# Altium schematic sheet BatteryBalancing.SchDoc: Active Cell Balancing Circuit
size 279 x 215 mm; Engineer: Ari Wasch; Revision: 2; SheetNumber: 2; SheetTotal: 2
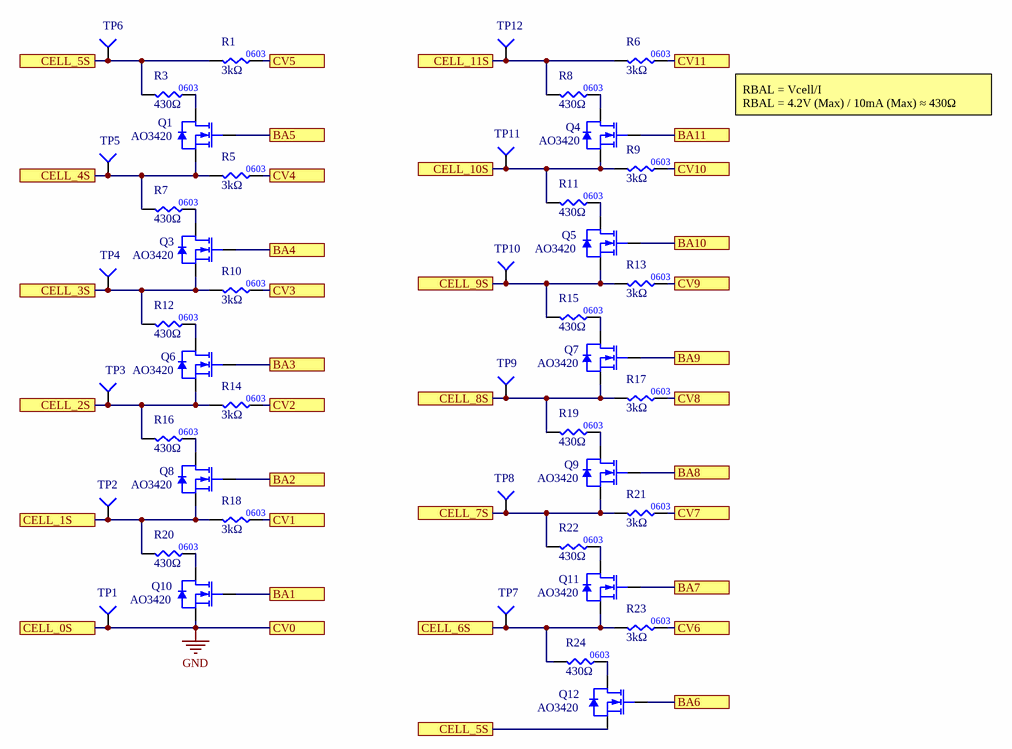
[diagram p0: BatteryBalancing.SchDoc]

## Parts
Q1  Manufacturer Part Number 1: AO3420  [SOT23-3]  (hidden comment: NMOS_20V_6A)
Q3  Manufacturer Part Number 1: AO3420  [SOT23-3]  (hidden comment: NMOS_20V_6A)
Q4  Manufacturer Part Number 1: AO3420  [SOT23-3]  (hidden comment: NMOS_20V_6A)
Q5  Manufacturer Part Number 1: AO3420  [SOT23-3]  (hidden comment: NMOS_20V_6A)
Q6  Manufacturer Part Number 1: AO3420  [SOT23-3]  (hidden comment: NMOS_20V_6A)
Q7  Manufacturer Part Number 1: AO3420  [SOT23-3]  (hidden comment: NMOS_20V_6A)
Q8  Manufacturer Part Number 1: AO3420  [SOT23-3]  (hidden comment: NMOS_20V_6A)
Q9  Manufacturer Part Number 1: AO3420  [SOT23-3]  (hidden comment: NMOS_20V_6A)
Q10  Manufacturer Part Number 1: AO3420  [SOT23-3]  (hidden comment: NMOS_20V_6A)
Q11  Manufacturer Part Number 1: AO3420  [SOT23-3]  (hidden comment: NMOS_20V_6A)
Q12  Manufacturer Part Number 1: AO3420  [SOT23-3]  (hidden comment: NMOS_20V_6A)
R1  value 3kΩ  [RES0603]  (hidden comment: RES_3kΩ_0603_1%)
R3  value 430Ω  [RES0603]  (hidden comment: RES_430Ω_0603_5%)
R5  value 3kΩ  [RES0603]  (hidden comment: RES_3kΩ_0603_1%)
R6  value 3kΩ  [RES0603]  (hidden comment: RES_3kΩ_0603_1%)
R7  value 430Ω  [RES0603]  (hidden comment: RES_430Ω_0603_5%)
R8  value 430Ω  [RES0603]  (hidden comment: RES_430Ω_0603_5%)
R9  value 3kΩ  [RES0603]  (hidden comment: RES_3kΩ_0603_1%)
R10  value 3kΩ  [RES0603]  (hidden comment: RES_3kΩ_0603_1%)
R11  value 430Ω  [RES0603]  (hidden comment: RES_430Ω_0603_5%)
R12  value 430Ω  [RES0603]  (hidden comment: RES_430Ω_0603_5%)
R13  value 3kΩ  [RES0603]  (hidden comment: RES_3kΩ_0603_1%)
R14  value 3kΩ  [RES0603]  (hidden comment: RES_3kΩ_0603_1%)
R15  value 430Ω  [RES0603]  (hidden comment: RES_430Ω_0603_5%)
R16  value 430Ω  [RES0603]  (hidden comment: RES_430Ω_0603_5%)
R17  value 3kΩ  [RES0603]  (hidden comment: RES_3kΩ_0603_1%)
R18  value 3kΩ  [RES0603]  (hidden comment: RES_3kΩ_0603_1%)
R19  value 430Ω  [RES0603]  (hidden comment: RES_430Ω_0603_5%)
R20  value 430Ω  [RES0603]  (hidden comment: RES_430Ω_0603_5%)
R21  value 3kΩ  [RES0603]  (hidden comment: RES_3kΩ_0603_1%)
R22  value 430Ω  [RES0603]  (hidden comment: RES_430Ω_0603_5%)
R23  value 3kΩ  [RES0603]  (hidden comment: RES_3kΩ_0603_1%)
R24  value 430Ω  [RES0603]  (hidden comment: RES_430Ω_0603_5%)
TP1  TESTPOINT_1MM_SQUARE  [TESTPOINT_SQUARE_1MM]  (value not drawn)  (no BOM)
TP2  TESTPOINT_1MM_SQUARE  [TESTPOINT_SQUARE_1MM]  (value not drawn)  (no BOM)
TP3  TESTPOINT_1MM_SQUARE  [TESTPOINT_SQUARE_1MM]  (value not drawn)  (no BOM)
TP4  TESTPOINT_1MM_SQUARE  [TESTPOINT_SQUARE_1MM]  (value not drawn)  (no BOM)
TP5  TESTPOINT_1MM_SQUARE  [TESTPOINT_SQUARE_1MM]  (value not drawn)  (no BOM)
TP6  TESTPOINT_1MM_SQUARE  [TESTPOINT_SQUARE_1MM]  (value not drawn)  (no BOM)
TP7  TESTPOINT_1MM_SQUARE  [TESTPOINT_SQUARE_1MM]  (value not drawn)  (no BOM)
TP8  TESTPOINT_1MM_SQUARE  [TESTPOINT_SQUARE_1MM]  (value not drawn)  (no BOM)
TP9  TESTPOINT_1MM_SQUARE  [TESTPOINT_SQUARE_1MM]  (value not drawn)  (no BOM)
TP10  TESTPOINT_1MM_SQUARE  [TESTPOINT_SQUARE_1MM]  (value not drawn)  (no BOM)
TP11  TESTPOINT_1MM_SQUARE  [TESTPOINT_SQUARE_1MM]  (value not drawn)  (no BOM)
TP12  TESTPOINT_1MM_SQUARE  [TESTPOINT_SQUARE_1MM]  (value not drawn)  (no BOM)

## Ports
BA1, BA2, BA3, BA4, BA5, BA6, BA7, BA8, BA9, BA10, BA11, CELL_0S, CELL_1S, CELL_2S, CELL_3S, CELL_4S, CELL_5S, CELL_6S, CELL_7S, CELL_8S, CELL_9S, CELL_10S, CELL_11S, CV0, CV1, CV2, CV3, CV4, CV5, CV6, CV7, CV8, CV9, CV10, CV11

## Nets
GND: Q10.2(SOURCE) TP1.1(=value) ; port CELL_0S, port CV0
BA1: Q10.1(GATE) ; port BA1
BA2: Q8.1(GATE) ; port BA2
BA3: Q6.1(GATE) ; port BA3
BA4: Q3.1(GATE) ; port BA4
BA5: Q1.1(GATE) ; port BA5
BA6: Q12.1(GATE) ; port BA6
BA7: Q11.1(GATE) ; port BA7
BA8: Q9.1(GATE) ; port BA8
BA9: Q7.1(GATE) ; port BA9
BA10: Q5.1(GATE) ; port BA10
BA11: Q4.1(GATE) ; port BA11
CELL_1S: Q8.2(SOURCE) R18.1 R20.1 TP2.1(=value) ; port CELL_1S
CELL_2S: Q6.2(SOURCE) R14.1 R16.1 TP3.1(=value) ; port CELL_2S
CELL_3S: Q3.2(SOURCE) R10.1 R12.1 TP4.1(=value) ; port CELL_3S
CELL_4S: Q1.2(SOURCE) R5.1 R7.1 TP5.1(=value) ; port CELL_4S
CELL_5S: Q12.2(SOURCE) R1.1 R3.1 TP6.1(=value) ; port CELL_5S
CELL_6S: Q11.2(SOURCE) R23.1 R24.1 TP7.1(=value) ; port CELL_6S
CELL_7S: Q9.2(SOURCE) R21.1 R22.1 TP8.1(=value) ; port CELL_7S
CELL_8S: Q7.2(SOURCE) R17.1 R19.1 TP9.1(=value) ; port CELL_8S
CELL_9S: Q5.2(SOURCE) R13.1 R15.1 TP10.1(=value) ; port CELL_9S
CELL_10S: Q4.2(SOURCE) R9.1 R11.1 TP11.1(=value) ; port CELL_10S
CELL_11S: R6.1 R8.1 TP12.1(=value) ; port CELL_11S
CV1: R18.2 ; port CV1
CV2: R14.2 ; port CV2
CV3: R10.2 ; port CV3
CV4: R5.2 ; port CV4
CV5: R1.2 ; port CV5
CV6: R23.2 ; port CV6
CV7: R21.2 ; port CV7
CV8: R17.2 ; port CV8
CV9: R13.2 ; port CV9
CV10: R9.2 ; port CV10
CV11: R6.2 ; port CV11
NetQ1_3: Q1.3(DRAIN) R3.2
NetQ3_3: Q3.3(DRAIN) R7.2
NetQ4_3: Q4.3(DRAIN) R8.2
NetQ5_3: Q5.3(DRAIN) R11.2
NetQ6_3: Q6.3(DRAIN) R12.2
NetQ7_3: Q7.3(DRAIN) R15.2
NetQ8_3: Q8.3(DRAIN) R16.2
NetQ9_3: Q9.3(DRAIN) R19.2
NetQ10_3: Q10.3(DRAIN) R20.2
NetQ11_3: Q11.3(DRAIN) R22.2
NetQ12_3: Q12.3(DRAIN) R24.2

## Notes on the sheet
- RBAL = Vcell/I
  RBAL = 4.2V (Max) / 10mA (Max) ≈ 430Ω
- University of Waterloo Robotics Team
- 200 University Ave W
- REV
- PROJECT
- Waterloo, Ontario, Canada
- N2L 3G1
- DOCUMENT
- ENGINEER
- REVIEWER
- MODIFIED
- SHEET
- OF
- (in symbol RES_3kΩ_0603_1%) 0603

## Library data of the parts
Q1 Q3-Q12 = NMOS_20V_6A: MOSFET N-CH 20V 6A SOT-23; Manufacturer 1: Alpha & Omega; Supplier 1: Digi-Key; Supplier Part Number 1: 785-1014-2-ND
R1 R5 R6 R9 R10 R13 R14 R17 R18 R21 R23 = RES_3kΩ_0603_1%: RES 3K OHM 1% 1/10W 0603; Manufacturer 1: Yageo; Manufacturer Part Number 1: RC0603FR-073KL; Supplier 1: Digi-Key; Supplier Part Number 1: 311-3.00KHRCT-ND
R3 R7 R8 R11 R12 R15 R16 R19 R20 R22 R24 = RES_430Ω_0603_5%: RES 430 OHM 5% 1/10W 0603; Manufacturer 1: Stackpole Electronics; Manufacturer Part Number 1: RMCF0603JT430R; Package/Footprint: 0603; Supplier Part Number 1: RMCF0603JT430R; Supplier 1: Digi-Key; Mounting Type: SMD
TP1 = TESTPOINT_1MM_SQUARE: CELL0
TP2 = TESTPOINT_1MM_SQUARE: CELL1
TP3 = TESTPOINT_1MM_SQUARE: CELL2
TP4 = TESTPOINT_1MM_SQUARE: CELL3
TP5 = TESTPOINT_1MM_SQUARE: CELL4
TP6 = TESTPOINT_1MM_SQUARE: CELL5
TP7 = TESTPOINT_1MM_SQUARE: CELL6
TP8 = TESTPOINT_1MM_SQUARE: CELL7
TP9 = TESTPOINT_1MM_SQUARE: CELL8
TP10 = TESTPOINT_1MM_SQUARE: CELL9
TP11 = TESTPOINT_1MM_SQUARE: CELL10
TP12 = TESTPOINT_1MM_SQUARE: CELL11